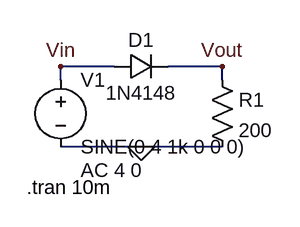
[diagram p0: schematic 9b.asc]
9b.asc, the LTspice schematic file:
Version 4
SHEET 1 880 680
WIRE 176 96 112 96
WIRE 304 96 240 96
WIRE 112 112 112 96
WIRE 304 112 304 96
WIRE 208 192 112 192
WIRE 304 192 208 192
FLAG 208 192 0
FLAG 304 96 Vout
FLAG 112 96 Vin
SYMBOL voltage 112 96 R0
WINDOW 123 24 124 Left 2
WINDOW 39 0 0 Left 0
SYMATTR Value2 AC 4 0
SYMATTR InstName V1
SYMATTR Value SINE(0 4 1k 0 0 0)
SYMBOL diode 176 112 R270
WINDOW 0 32 32 VTop 2
WINDOW 3 0 32 VBottom 2
SYMATTR InstName D1
SYMATTR Value 1N4148
SYMBOL res 288 96 R0
SYMATTR InstName R1
SYMATTR Value 200
TEXT 72 240 Left 2 !.tran 10m

The netlist it stands for:
* 9b.asc
V1 Vin 0 SINE(0 4 1k 0 0 0) AC 4 0
D1 Vin Vout 1N4148
R1 Vout 0 200
.model D D
.lib standard.dio
.tran 10m
.backanno
.end